# Altium schematic sheet MCU2.SchDoc: MCU2
size 420 x 297 mm; Address1: Address1; Address2: Address2; Address3: Address3; Address4: Address4; DocumentNumber: SSI.DB.0.001; SheetNumber: 1; Scale: 1:1; DocumentType: Схема электрическая принципиальная; FirstReferrence: АБВГ.123456.001
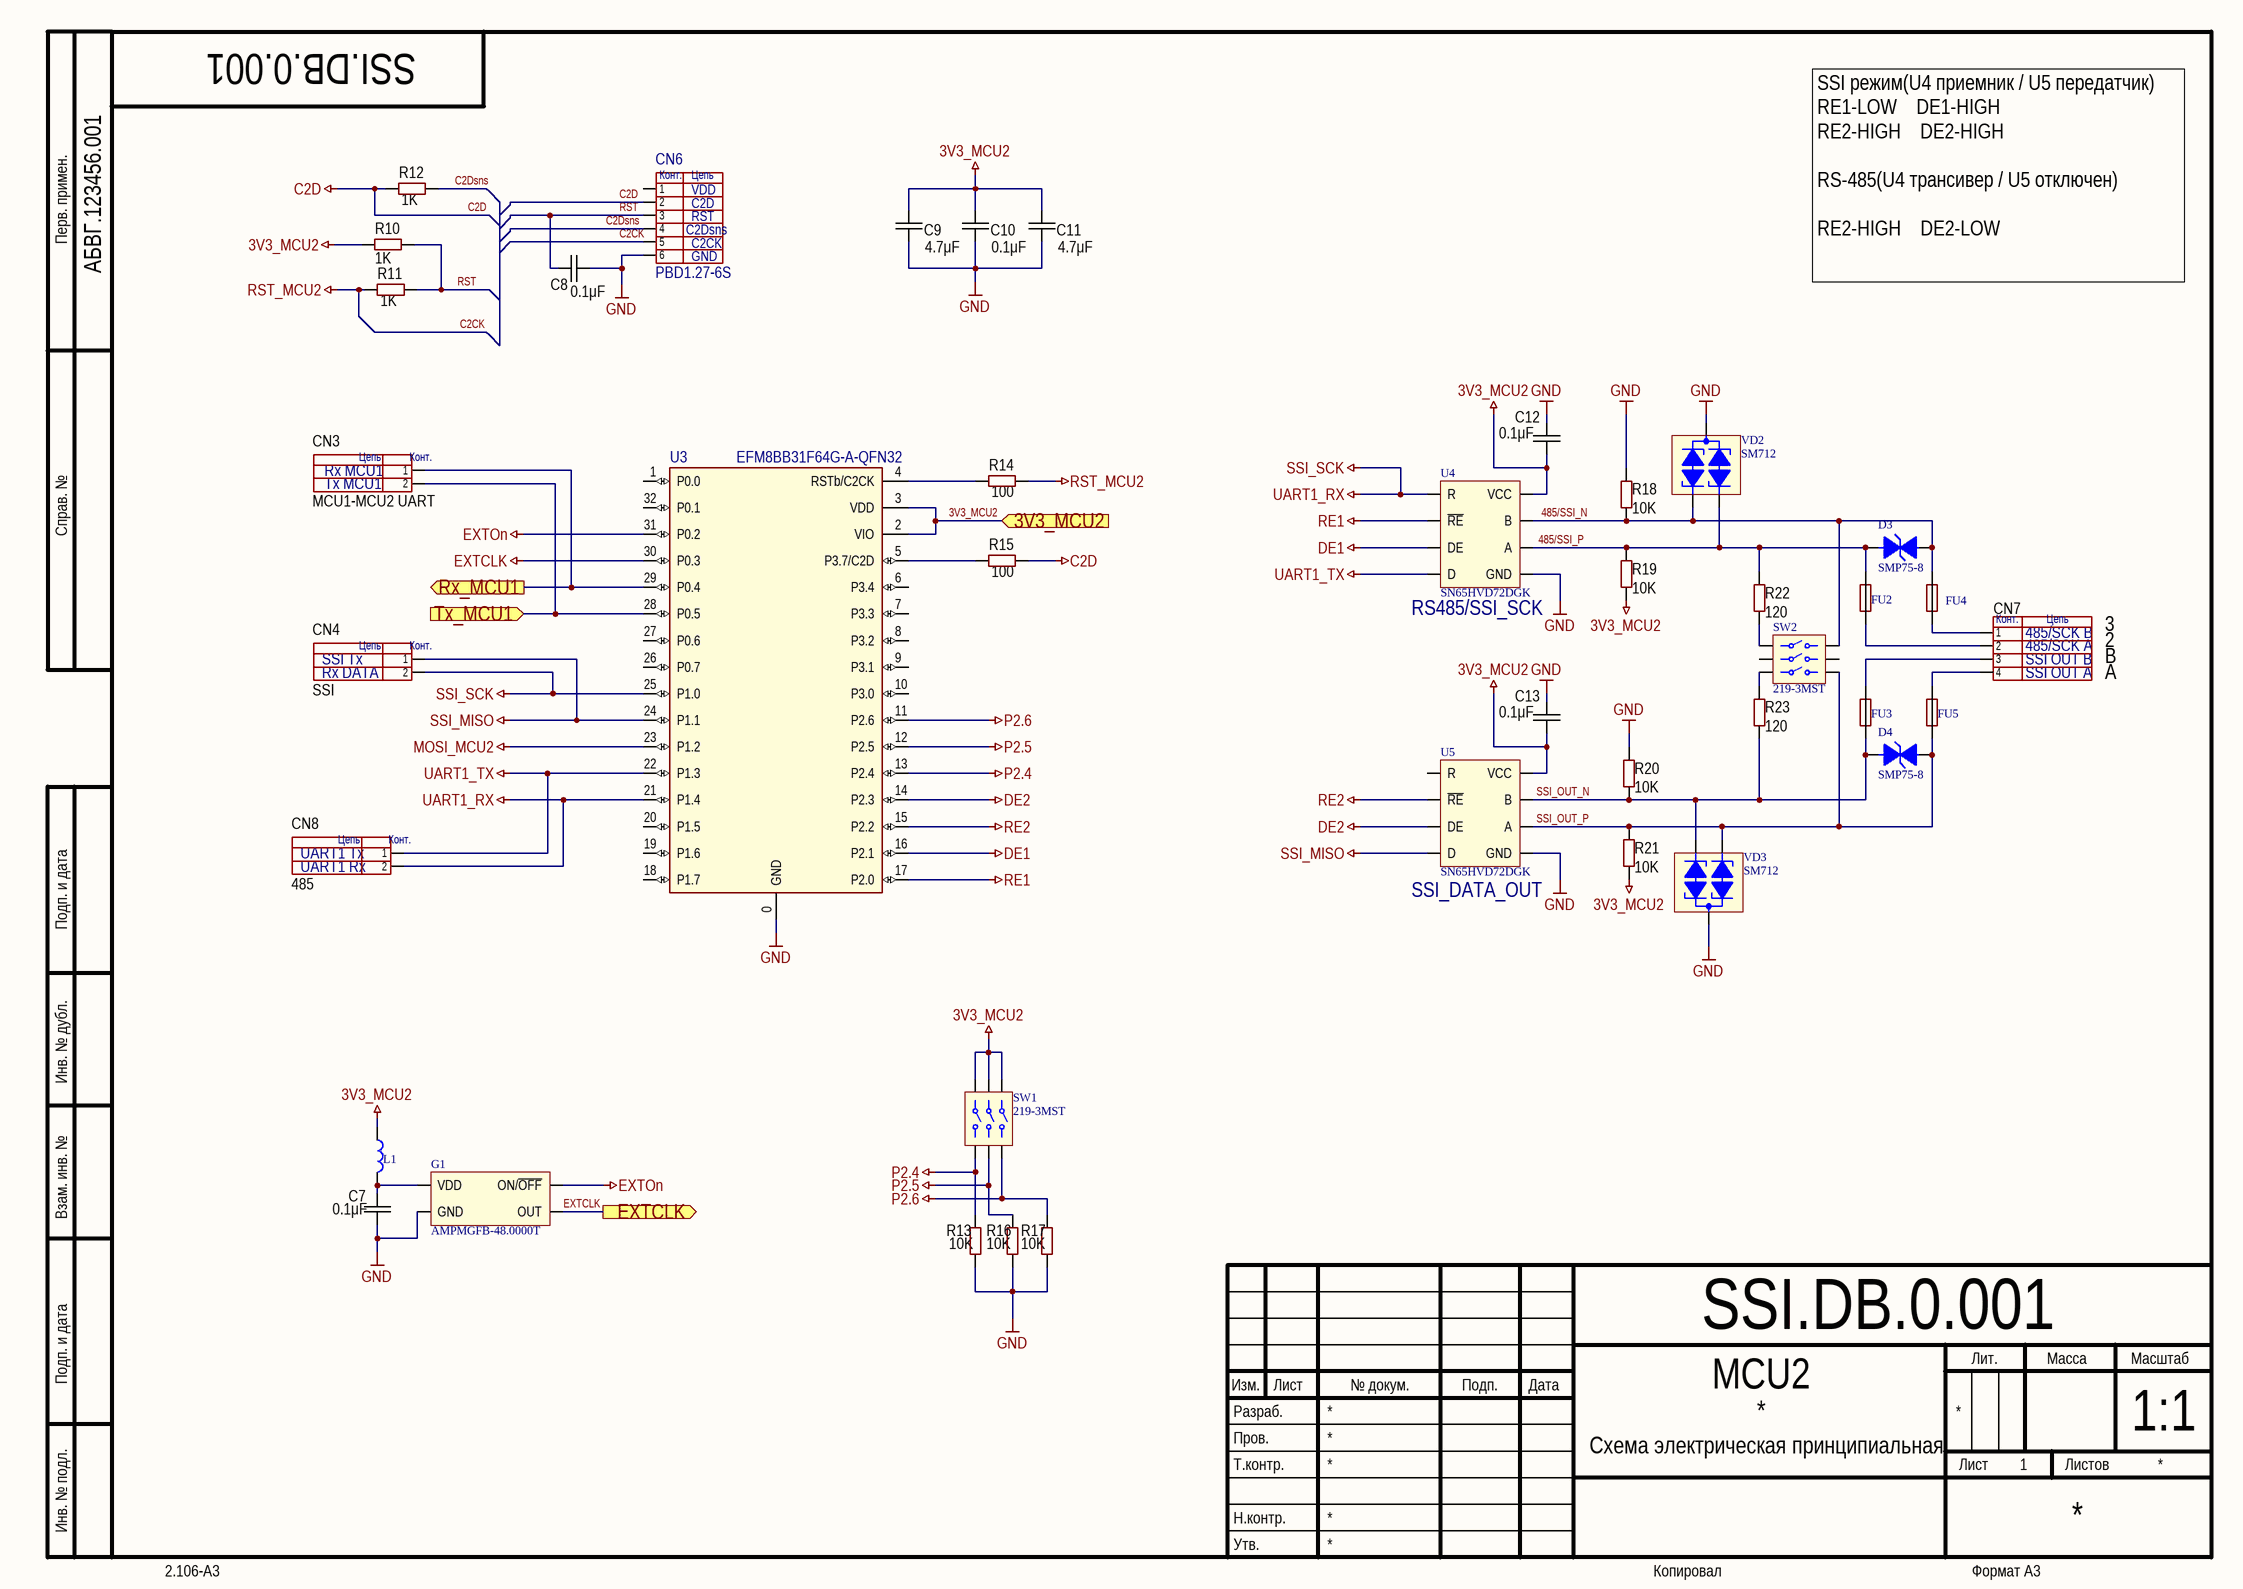
[diagram p0: MCU2.SchDoc]

## Parts
C7  value 0.1μF  [CAP: 0603]
C8  value 0.1μF  [CAP: 0603]
C9  value 4.7μF  [CAP: 0603]
C10  value 0.1μF  [CAP: 0603]
C11  value 4.7μF  [CAP: 0603]
C12  value 0.1μF  [CAP: 0603]
C13  value 0.1μF  [CAP: 0603]
CN3  CommentText: MCU1-MCU2 UART  [CON: PLS-2]
CN4  CommentText: SSI  [CON: PLS-2]
CN6  PBD1.27-6S  [CON:PBD1.27-6]
CN7  (no value)  [CON: PLS-4]
CN8  CommentText: 485  [CON: PLS-2]
D3  SMP75-8  [DIODE: SMB]
D4  SMP75-8  [DIODE: SMB]
FU2  0zcm0002ff2g  [FUSE: 0603]  (value not drawn)
FU3  0zcm0002ff2g  [FUSE: 0603]  (value not drawn)
FU4  0zcm0002ff2g  [FUSE: 0603]  (value not drawn)
FU5  0zcm0002ff2g  [FUSE: 0603]  (value not drawn)
G1  AMPMGFB-48.0000T  [AMPMGFB(1.6x1.2)]
L1  BLM18AG102SN1D  [IND: 0603]  (value not drawn)
R10  value 1K  [RES: 0603]
R11  value 1K  [RES: 0603]
R12  value 1K  [RES: 0603]
R13  value 10K  [RES: 0603]
R14  value 100  [RES: 0603]
R15  value 100  [RES: 0603]
R16  value 10K  [RES: 0603]
R17  value 10K  [RES: 0603]
R18  value 10K  [RES: 0603]
R19  value 10K  [RES: 0603]
R20  value 10K  [RES: 0603]
R21  value 10K  [RES: 0603]
R22  value 120  [RES: 0603]
R23  value 120  [RES: 0603]
SW1  219-3MST  [219-3MST]
SW2  219-3MST  [219-3MST]
U3  EFM8BB31F64G-A-QFN32  [32-QFN(4x4)]
U4  SN65HVD72DGK  [8-SOIC]
U5  SN65HVD72DGK  [8-SOIC]
VD2  SM712  [SOT23]
VD3  SM712  [SOT23]

## Ports
3V3_MCU2 (in), EXTCLK (out), Rx_MCU1 (out), Tx_MCU1 (in)

## Nets
3V3_MCU2: C9.2 C10.2 C11.2 C12.1 C13.1 L1.1 R10.1 R19.2 R21.2 SW1.1 SW1.2 SW1.3 U3.2(VIO) U3.3(VDD) U4.8(VCC) U5.8(VCC) ; port 3V3_MCU2
C2CK: CN6.5 R11.2 R14.1  [also labelled RST_MCU2]
C2D: CN6.2 R12.2 R15.1
DE1: U3.16(P2.1) U4.3(DE)
DE2: U3.14(P2.3) U5.3(DE)
EXTCLK: G1.3(OUT) U3.30(P0.3) ; port EXTCLK
EXTOn: G1.1(ON/~{OFF}) U3.31(P0.2)
GND: C7.1 C8.1 C9.1 C10.1 C11.1 C12.2 C13.2 CN6.6 G1.2(GND) R13.1 R16.1 R17.1 R18.1 R20.1 U3.0(GND) U4.5(GND) U5.5(GND) VD2.3 VD3.3
MOSI_MCU2: U3.23(P1.2)
P2.4: R13.2 SW1.4 U3.13(P2.4)
P2.5: R16.2 SW1.5 U3.12(P2.5)
P2.6: R17.2 SW1.6 U3.11(P2.6)
RE1: U3.17(P2.0) U4.2(~{RE})
RE2: U3.15(P2.2) U5.2(~{RE})
SSI_MISO: CN4.1 U3.24(P1.1) U5.4(D)
SSI_SCK: CN4.2 CN8.2 U3.21(P1.4) U3.25(P1.0) U4.1(R)  [also labelled UART1_RX]
UART1_TX: CN8.1 U3.22(P1.3) U4.4(D)
485/SSI_N: D3.2 FU4.2 R18.2 SW2.6 U4.7(B) VD2.1
485/SSI_P: D3.1 FU2.2 R19.1 R22.1 U4.6(A) VD2.2
C2Dsns: CN6.4 R12.1
RST: C8.2 CN6.3 R10.2 R11.1
Rx_MCU1: CN3.1 U3.29(P0.4) ; port Rx_MCU1
SSI_OUT_N: D4.1 FU3.1 R20.2 R23.2 U5.7(B) VD3.2
SSI_OUT_P: D4.2 FU5.1 R21.1 SW2.4 U5.6(A) VD3.1
Tx_MCU1: CN3.2 U3.28(P0.5) ; port Tx_MCU1
NetC7_2: C7.2 G1.4(VDD) L1.2
NetCN7_1: CN7.1 FU4.1
NetCN7_2: CN7.2 FU2.1
NetCN7_3: CN7.3 FU3.2
NetCN7_4: CN7.4 FU5.2
NetR14_2: R14.2 U3.4(RSTb/C2CK)
NetR15_2: R15.2 U3.5(P3.7/C2D)
NetR22_2: R22.2 SW2.1
NetR23_1: R23.1 SW2.3

Not connected (* = marked no-connect by the designer): CN6 1; SW2 2 5; U3 1(P0.0) 6(P3.4) 7(P3.3) 8(P3.2) 9(P3.1) 10(P3.0) 18(P1.7) 19(P1.6) 20(P1.5) 26(P0.7) 27(P0.6) 32(P0.1); U5 1(R)

## Notes on the sheet
- (near CN6) VDD
- (near CN6) C2Dsns
- (near CN6) C2D
- (near CN6) RST
- (near CN6) C2CK
- (near CN6) GND
- SSI режим(U4 приемник / U5 передатчик)
  RE1-LOW    DE1-HIGH
  RE2-HIGH    DE2-HIGH
  RS-485(U4 трансивер / U5 отключен)
  RE2-HIGH    DE2-LOW
- (near CN3) Rx MCU1
- (near CN3) Tx MCU1
- (near CN4) SSI Tx
- (near U4) RS485/SSI_SCK
- (near CN7) 485/SCK B
- (near CN7) 485/SCK A
- (near CN7) SSI OUT B
- 3
- 2
- B
- (near CN4) Rx DATA
- (near CN7) SSI OUT A
- A
- (near CN8) UART1 Tx
- (near CN8) UART1 Rx
- (near U5) SSI_DATA_OUT
- Перв. примен.
- Справ. №
- Подп. и дата
- Инв. № дубл.
- Взам. инв. №
- Разраб.
- Изм.
- Лист
- № докум.
- Подп.
- Дата
- Лит.
- Масса
- Масштаб
- Пров.
- Т.контр.
- Листов
- Инв. № подл.
- Утв.
- Н.контр.
- 2.106-A3
- Копировал
- Формат А3
- (in symbol PBD1.27-6S) Конт.; Цепь
- (in symbol PLS-2) Цепь; Конт.
- (in symbol PLS-4) Конт.; Цепь

## Library data of the parts
C7 C8 C10 C12 C13 = Ceramic_0603: Manufacturer: Yageo; PartNumber: CC0603KRX7R7BB104; ValueManufacturerPartNumber: Ceramic capacitor, 0.1μF, X7R, ±10%, 50V, 0603, -55...+125°C; TypeCapacitor: Ceramic capacitor; Tolerance: ±10%; TypeDielectric: X7R; Voltage: 50V; Package: 0603; HelpURL: https://www.digikey.com/product-detail/en/yageo/CC0603KRX7R7BB104/311-1088-1-ND/302998; Temperature: -55...+125°C
C9 C11 = Ceramic_0603: Manufacturer: Yageo; PartNumber: CC0603KRX7R7BB104; ValueManufacturerPartNumber: Ceramic capacitor, 4.7μF, X7R, ±10%, 10V, 0603, -55...+125°C; TypeCapacitor: Ceramic capacitor; Tolerance: ±10%; TypeDielectric: X7R; Voltage: 10V; Package: 0603; HelpURL: https://www.digikey.com/product-detail/en/yageo/CC0603KRX7R7BB104/311-1088-1-ND/302998; Temperature: -55...+125°C
CN3 CN4 CN8 = PLS-2: Manufacturer: Connfly; ValueManufacturerPartNumber: Connector, 2pin, 2.54mm, 500VAC, 3A; TypeConnector: Connector; VoltageMax: 500VAC; Pitch: 2.54mm; CurrentMax: 3A; Multichannel: 2pin; HelpURL: https://www.chipdip.ru/product/pls-2; PartNumber: PLS-2
CN7 = PLS-4: Manufacturer: Connfly; ValueManufacturerPartNumber: Connector, 4pin, 2.54mm, 500VAC, 3A; TypeConnector: Connector; VoltageMax: 500VAC; Pitch: 2.54mm; CurrentMax: 3A; Multichannel: 4pin; HelpURL: https://www.chipdip.ru/product/pls-4; PartNumber: PLS-4
D3 D4 = SMBJ10CA-TR
FU2-FU5 = FUSE:0603
L1 = BLM18AG102SN1D: 100MHz 1K
R10-R12 = Resistor_0603: Manufacturer: Yageo; PartNumber: RC0603JR-07100RL; ValueManufacturerPartNumber: Resistor film, 1K, ±1%, 0603, 0.1W, -55...+125°C; TypeResistor: Resistor film; Power: 0.1W; Tolerance: ±1%; Package: 0603; HelpURL: https://www.digikey.com/product-detail/en/yageo/RC0603JR-07100RL/311-100GRCT-ND/729644; Temperature: -55...+125°C
R13 R16-R21 = Resistor_0603: Manufacturer: Yageo; PartNumber: RC0603JR-07100RL; ValueManufacturerPartNumber: Resistor film, 10K, ±1%, 0603, 0.1W, -55...+125°C; TypeResistor: Resistor film; Power: 0.1W; Tolerance: ±1%; Package: 0603; HelpURL: https://www.digikey.com/product-detail/en/yageo/RC0603JR-07100RL/311-100GRCT-ND/729644; Temperature: -55...+125°C
R14 R15 = Resistor_0603: Manufacturer: Yageo; PartNumber: RC0603JR-07100RL; ValueManufacturerPartNumber: Resistor film, 100, ±1%, 0603, 0.1W, -55...+125°C; TypeResistor: Resistor film; Power: 0.1W; Tolerance: ±1%; Package: 0603; HelpURL: https://www.digikey.com/product-detail/en/yageo/RC0603JR-07100RL/311-100GRCT-ND/729644; Temperature: -55...+125°C
R22 R23 = Resistor_0603: Manufacturer: Yageo; PartNumber: RC0603JR-07100RL; ValueManufacturerPartNumber: Resistor film, 120, ±1%, 0603, 0.1W, -55...+125°C; TypeResistor: Resistor film; Power: 0.1W; Tolerance: ±1%; Package: 0603; HelpURL: https://www.digikey.com/product-detail/en/yageo/RC0603JR-07100RL/311-100GRCT-ND/729644; Temperature: -55...+125°C
U3 = EFM8BB31F64G-A-QFN32: 8051 MCU Core
U4 U5 = SN65HVD72DGK: RS-485
VD2 VD3 = SM712: EIA RS-485 ±7V